# Altium project disarm_it.PrjPcb
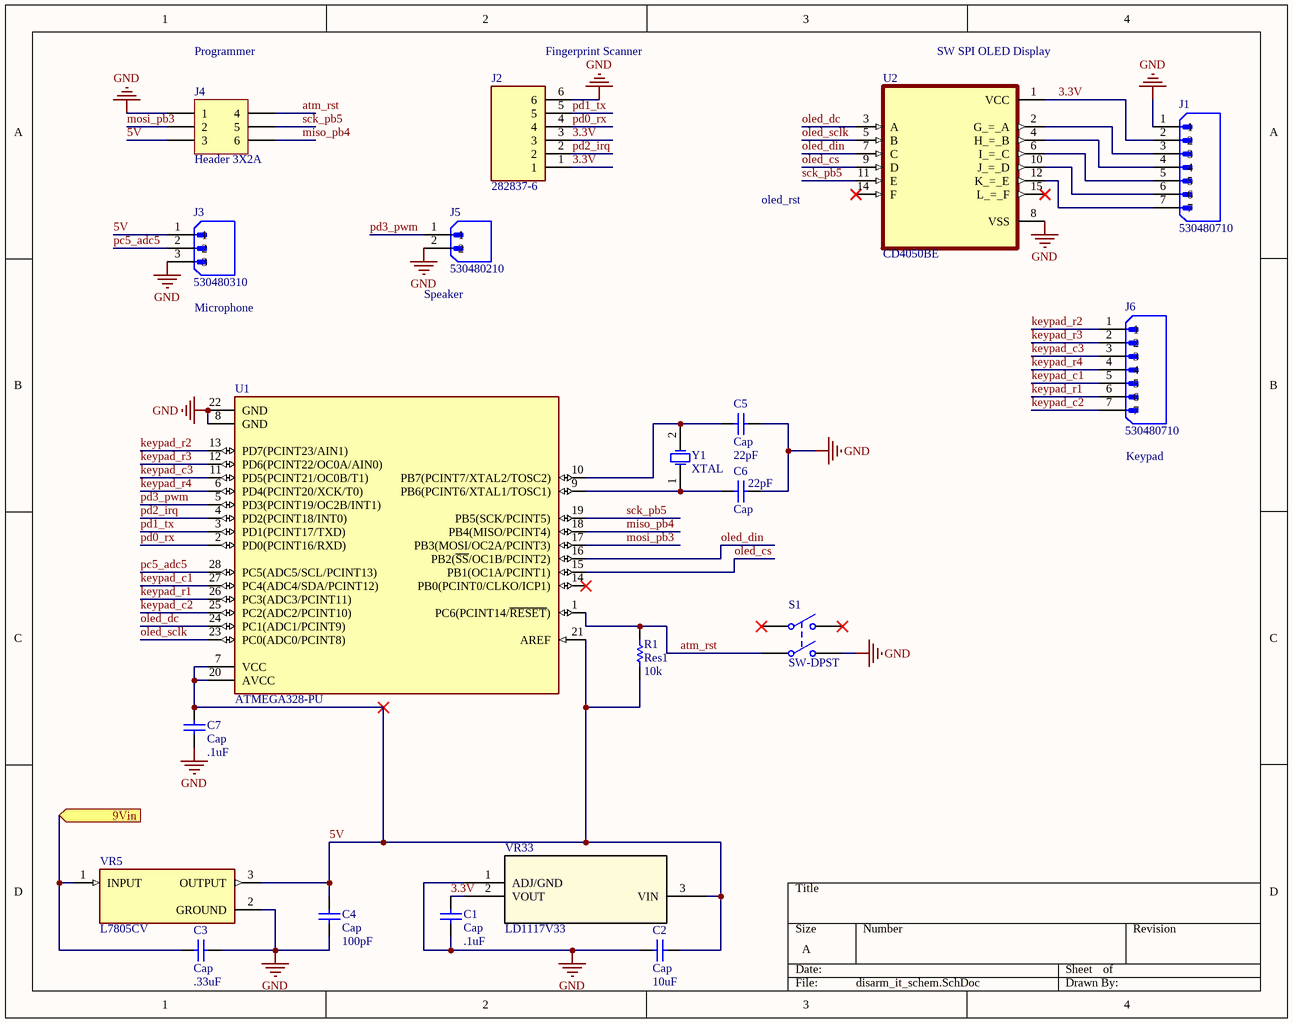
[diagram p0: disarm_it_schem.SchDoc]
1 sheet, 20 parts. Net scope: flat (ports and power ports of the same name join across sheets).
Board file: disarm_it.PcbDoc

## Sheet disarm_it_schem.SchDoc
size A; SheetNumber: 1; SheetTotal: 1; SPICEModelCacheQLBSSEVD: <root> / <DocumentId>QLBSSEVD</DocumentId> / <CacheFrame Number="0"> / <Model Name="cap" Kind="MDL"> / <Text>*Default semiconductor capacitor / .MODEL CAP C()</Text> / </Model> / <Model Name="xtal" Kind="CKT"> / <Text>*Generic type:crystal pkg:HC33/51 / .SUBCKT XTAL 1 2 PARAMS: FREQ=1Meg RS=750 C=13pf Q=1000 / LX 1 3 {((Q*RS)/(6.2831852*FREQ))} IC=0.5M / CX 3 4 {(1/(Q*6.2831852*FREQ*RS))} / C0 1 2 {C} / RS 4 2 {RS} / .ENDS XTAL</Text> / </Model> / <Model Name="led1" Kind="MDL"> / <Text>*Typ RED GaAs LED: Vf=1.7V Vr=4V If=40mA trr=3uS / *LED Pinout: 1=A, 2=K / .MODEL LED1 D (IS=93.2P RS=42M N=3.73 BV=4 IBV=10U / + CJO=2.97P VJ=.75 M=.333 TT=4.32U)</Text> / </Model> / </CacheFrame> / </root>

### Parts
C1  Cap  value .1uF  [RAD-0.3]
C2  Cap  value 10uF  [RAD-0.3]
C3  Cap  value .33uF  [RAD-0.3]
C4  Cap  value 100pF  [RAD-0.3]
C5  Cap  value 22pF  [RAD-0.3]
C6  Cap  value 22pF  [RAD-0.3]
C7  Cap  value .1uF  [RAD-0.3]
J1  530480710  [MOLEX_530480710]
J2  282837-6  [TE_282837-6]
J3  530480310  [MOLEX_530480310]
J4  Header 3X2A  [HDR2X3_CEN]
J5  530480210  [MOLEX_530480210]
J6  530480710  [MOLEX_530480710]
R1  Res1  value 10k  [AXIAL-0.3]
S1  SW-DPST  [DPST-4]
U1  ATMEGA328-PU  [DIP787W46P254L3467H508Q28]
U2  CD4050BE  [DIP794W45P254L1969H508Q16]
VR5  L7805CV  [TO255P1040X460X1968-3]
VR33  LD1117V33  [TO-220_STM]
Y1  XTAL  [R38]

### Ports
9Vin (in)

### Nets
GND: C1.1 C2.2 C3.2 C4.2 C5.2 C6.2 C7.1 J1.1 J2.6 J3.3 J4.1 J5.2 S1.4(NO2) U1.8(GND) U1.22(GND) U2.8(VSS) VR5.2(GROUND) VR33.1(ADJ/GND)
3.3V: C1.2 J1.2 J2.1 J2.3 U2.1(VCC) VR33.2(VOUT)
5V: C2.1 C4.1 C7.2 J3.1 J4.3 R1.1 U1.7(VCC) U1.20(AVCC) U1.21(AREF) VR5.3(OUTPUT) VR33.3(VIN)
atm_rst: J4.4 R1.2 S1.3(COMMON2) U1.1(PC6(PCINT14/~{RESET}))
keypad_c1: J6.5 U1.27(PC4(ADC4/SDA/PCINT12))
keypad_c2: J6.7 U1.25(PC2(ADC2/PCINT10))
keypad_c3: J6.3 U1.11(PD5(PCINT21/OC0B/T1))
keypad_r1: J6.6 U1.26(PC3(ADC3/PCINT11))
keypad_r2: J6.1 U1.13(PD7(PCINT23/AIN1))
keypad_r3: J6.2 U1.12(PD6(PCINT22/OC0A/AIN0))
keypad_r4: J6.4 U1.6(PD4(PCINT20/XCK/T0))
miso_pb4: J4.6 U1.18(PB4(MISO/PCINT4))
mosi_pb3: J4.2 U1.17(PB3(MOSI/OC2A/PCINT3))
oled_cs: U1.15(PB1(OC1A/PCINT1)) U2.9(D)
oled_dc: U1.24(PC1(ADC1/PCINT9)) U2.3(A)
oled_din: U1.16(PB2(~{SS}/OC1B/PCINT2)) U2.7(C)
oled_sclk: U1.23(PC0(ADC0/PCINT8)) U2.5(B)
pc5_adc5: J3.2 U1.28(PC5(ADC5/SCL/PCINT13))
pd0_rx: J2.4 U1.2(PD0(PCINT16/RXD))
pd1_tx: J2.5 U1.3(PD1(PCINT17/TXD))
pd2_irq: J2.2 U1.4(PD2(PCINT18/INT0))
pd3_pwm: J5.1 U1.5(PD3(PCINT19/OC2B/INT1))
sck_pb5: J4.5 U1.19(PB5(SCK/PCINT5)) U2.11(E)
NetC3_1: C3.1 VR5.1(INPUT) ; port 9Vin
NetC5_1: C5.1 U1.10(PB7(PCINT7/XTAL2/TOSC2)) Y1.2(OSC2)
NetC6_1: C6.1 U1.9(PB6(PCINT6/XTAL1/TOSC1)) Y1.1(OSC1)
NetJ1_3: J1.3 U2.2(G_=_A)
NetJ1_4: J1.4 U2.4(H_=_B)
NetJ1_5: J1.5 U2.6(I_=_C)
NetJ1_6: J1.6 U2.10(J_=_D)
NetJ1_7: J1.7 U2.12(K_=_E)

Not connected (* = marked no-connect by the designer): S1 1(COMMON1)* 2(NO1)*; U1 14(PB0(PCINT0/CLKO/ICP1))*; U2 14(F)* 15(L_=_F)*

### Notes on the sheet
- Programmer
- (near J2) Fingerprint Scanner
- (near U2) SW SPI OLED Display
- oled_rst
- (near J5) Speaker
- (near J3) Microphone
- (near J6) Keypad

### Library data of the parts
C1-C7 = Cap: Capacitor; Published: 8-Jun-2000; LatestRevisionDate: 17-Jul-2002; LatestRevisionNote: Re-released for DXP Platform.; PackageReference: RAD-0.3; Publisher: Altium Limited; PackageDescription: Radial Cap, Thru-Hole; 2 Leads; 0.3 in Pin Spacing
J2 = 282837-6: Conn Terminal Block F 6 POS 5.08mm Solder ST Thru-Hole 13.5A/Contact; MF: TE Connectivity; MP: 282837-6; Value: *; SnapEDA_Link: https://www.snapeda.com/parts/282837-6/TE%20Connectivity%20AMP%20Connectors/view-part/520355/?ref=snap; EU_RoHS_Compliance: Compliant with Exemptions; Price: None; Package: None; Check_prices: https://www.snapeda.com/parts/282837-6/TE%20Connectivity%20AMP%20Connectors/view-part/520355/?ref=eda; Availability: Warning
J3 = 530480310: Conn Shrouded Header (4 Sides) HDR 3 POS 1.25mm Solder RA Side Entry Thru-Hole PicoBladeâ„¢ Tray; MF: Molex; SnapEDA_Link: https://www.snapeda.com/parts/530480310/Molex/view-part/4593638/?ref=snap; Digi-Key_Part_Number: 2266-53048-0310-ND; Value: *; Check_prices: https://www.snapeda.com/parts/530480310/Molex/view-part/4593638/?ref=eda; Purchase-URL: https://pricing.snapeda.com/search/part/530480310/?ref=eda; Package: None; MP: 530480310
J4 = Header 3X2A: Header, 3-Pin, Dual row; LatestRevisionDate: 17-Jul-2002; LatestRevisionNote: Re-released for DXP Platform.; Publisher: Altium Limited
J5 = 530480210: Conn Shrouded Header (4 Sides) HDR 2 POS 1.25mm Solder RA Side Entry Thru-Hole PicoBladeâ„¢ Tray; MF: Molex; Purchase-URL: https://pricing.snapeda.com/search/part/530480210/?ref=eda; Package: None; SnapEDA_Link: https://www.snapeda.com/parts/530480210/Molex/view-part/4593640/?ref=snap; MP: 530480210; Value: *; Check_prices: https://www.snapeda.com/parts/530480210/Molex/view-part/4593640/?ref=eda; Digi-Key_Part_Number: 2266-53048-0210-ND
R1 = Res1: Resistor; Published: 8-Jun-2000; LatestRevisionDate: 17-Jul-2002; LatestRevisionNote: Re-released for DXP Platform.; PackageReference: AXIAL-0.3; Publisher: Altium Limited; PackageDescription: Axial Device, Thru-Hole; 2 Leads; 0.3 in Pin Spacing
S1 = SW-DPST: Double-Pole, Single-Throw Switch; Published: 24-Mar-1999; LatestRevisionDate: 17-Jul-2002; LatestRevisionNote: Re-released for DXP Platform.; PackageReference: DPST-4; Publisher: Altium Limited; PackageDescription: Switch; 4 Leads
U1 = ATMEGA328-PU: AVR AVRÂ® ATmega Microcontroller IC 8-Bit 20MHz 32KB (16K x 16) FLASH 28-PDIP; MF: Microchip Technology; Value: *; Package: DIP-28 Microchip Technology; Availability: In Stock; Check_prices: https://www.snapeda.com/parts/ATMEGA328-PU/Microchip/view-part/?ref=eda; SnapEDA_Link: https://www.snapeda.com/parts/ATMEGA328-PU/Microchip/view-part/?ref=snap; Purchase-URL: https://pricing.snapeda.com/search/part/ATMEGA328-PU/?ref=eda; MP: ATMEGA328-PU; Price: None
U2 = CD4050BE: CMOS Hex Non-Inverting Buffer/Converter 16-PDIP -55 to 125; MF: Texas Instruments; Price: None; Value: *; SnapEDA_Link: https://www.snapeda.com/parts/CD4050BE/Texas%20Instruments/view-part/546542/?ref=snap; Texas_Instruments-Purchase-URL: https://snapeda.com/shop?store=Texas+Instruments&id=546542; Mouser-Purchase-URL: https://snapeda.com/shop?store=Mouser&id=546542; Package: PDIP-16 Texas Instruments; Arrow_Electronics-Purchase-URL: https://snapeda.com/shop?store=Arrow+Electronics&id=546542; Availability: Good; MP: CD4050BE; DigiKey-Purchase-URL: https://snapeda.com/shop?store=DigiKey&id=546542
VR5 = L7805CV: Linear Voltage Regulator IC 1 Output 1.5A TO-220AB; MF: STMicroelectronics; Price: None; Package: TO-220 STMicroelectronics; Value: *; MP: L7805CV; Availability: Unavailable; SnapEDA_Link: https://www.snapeda.com/parts/L7805CV/STMicroelectronics/view-part/501150/?ref=snap
VR33 = LD1117V33: No Description Available; Mfr_Name: STMicroelectronics; Copyright: Copyright (C) 2022 Ultra Librarian. All rights reserved.; Manufacturer_Part_Number: LD1117V33; Digi-Key_Part_Number_1: 497-1491-5-ND; RefDes: RefDes; Type: DEV
Y1 = XTAL: Crystal Oscillator; Published: 8-Jun-2000; LatestRevisionDate: 17-Jul-2002; LatestRevisionNote: Re-released for DXP Platform.; PackageReference: R38; Publisher: Altium Limited; PackageDescription: Crystal, Thru-Hole; 2 Leads; Body 3.1 x 8.2 mm (Dia.xH)
J1 J6 = 530480710: MP: 530480710; Availability: Unavailable; Value: *; Package: None; Price: None